# Altium schematic sheet power.SchDoc: GPN-Badge
size A4; Address4: Niklas Fauth; Revision: V2.0; SheetNumber: 2; SheetTotal: 3
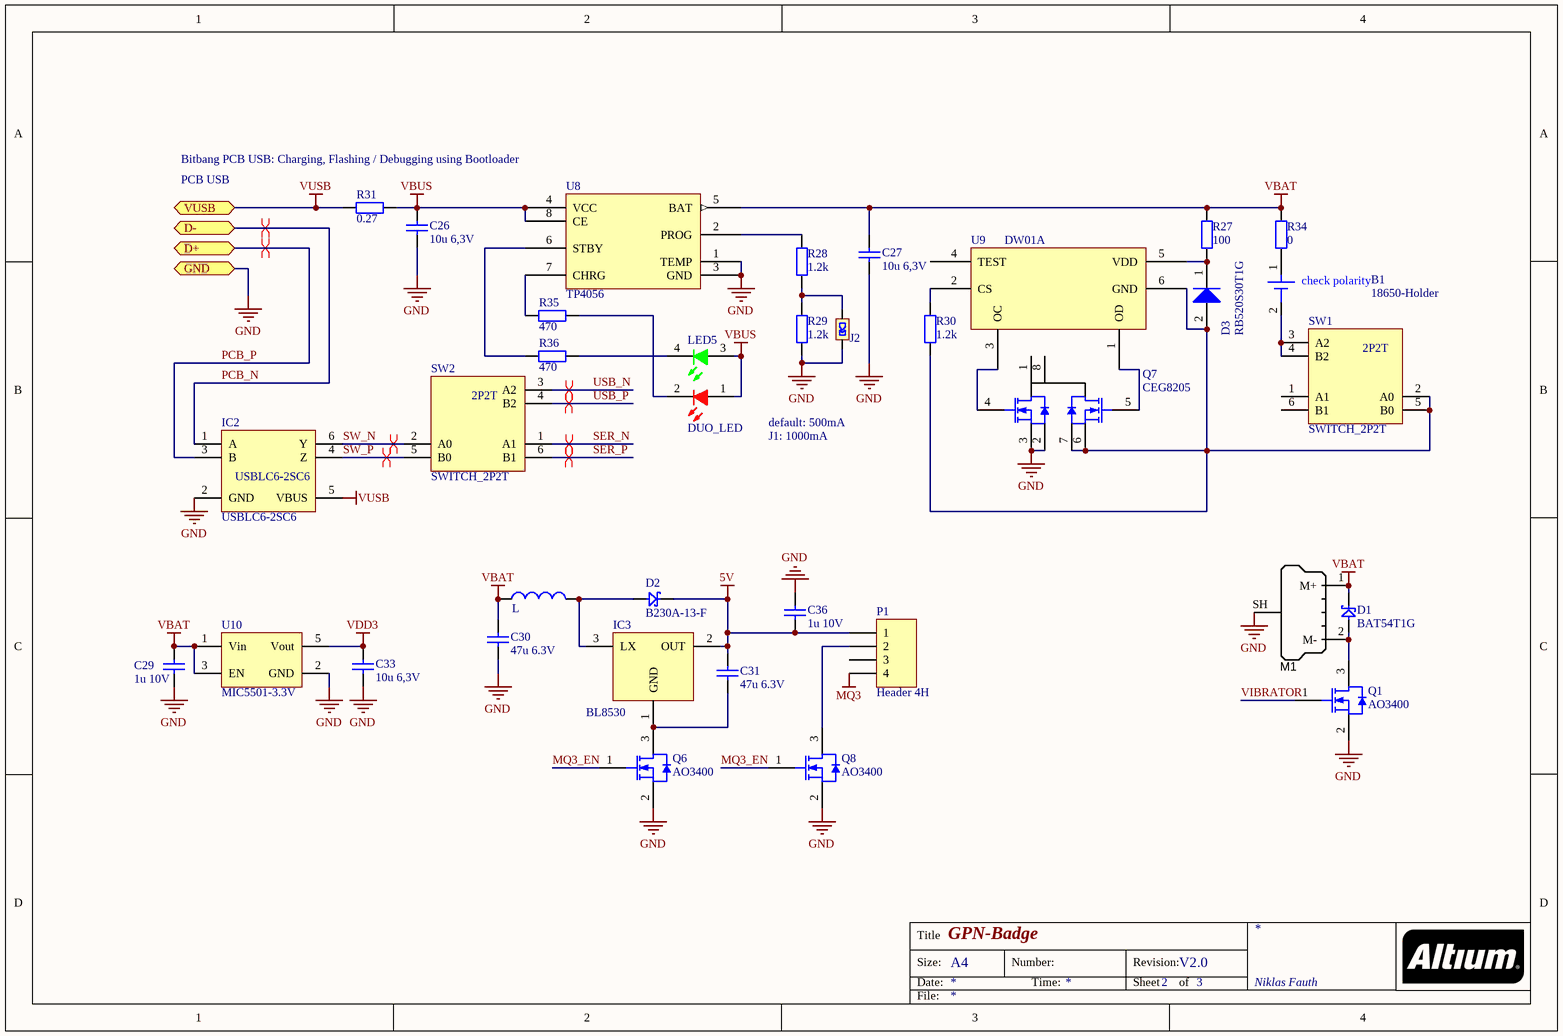
[diagram p0: power.SchDoc]

## Parts
B1  18650-Holder  [18650–Holder-SMD]
C26  10u 6,3V  [C-0603-H]
C27  10u 6,3V  [C-0603-H]
C29  1u 10V  [C-0603-M]
C30  47u 6.3V  [C-0805-M]
C31  47u 6.3V  [C-0805-M]
C33  10u 6,3V  [C-0603-H]
C36  1u 10V  [C-0603-M]
D1  BAT54T1G  [SOD123]
D2  B230A-13-F  [DIODE-SMA]
D3  RB520S30T1G  [ONSC-SOD-523-2-502-01_V]
IC2  USBLC6-2SC6  [SOT23-6]
IC3  BL8530  [SOT89-150P409X160-3N]
J2  jumper  [JUMPER 1-1]  (value not drawn)
L1  L  [L]
LED5  DUO_LED  [LEDDUO]
M1  VIBRATOR  [VIBRATOR_SMD]  (value not drawn)
P1  Header 4H  [HDR1X4H]
Q1  AO3400  [AO-SOT23-3_V]
Q6  AO3400  [AO-SOT23-3_V]
Q7  CEG8205  [SOP64P640X265-8N]
Q8  AO3400  [AO-SOT23-3_V]
R27  100  [R-0603-M]
R28  1.2k  [R-0603-M]
R29  1.2k  [R-0603-M]
R30  1.2k  [R-0603-M]
R31  0.27  [R-1206-M]
R34  0  [R-0603-M]
R35  470  [R-0603-M]
R36  470  [R-0603-M]
SW1  SWITCH_2P2T  [SWITCH_THT]
SW2  SWITCH_2P2T  [SWITCH_THT]
U8  TP4056  [SOIC127P600X20_HS-9N]
U9  DW01A  [SOT23-6]
U10  MIC5501-3.3V  [SOT23-5]

## Ports
D+, D-, GND, VUSB

## Nets
5V: C31.2 C36.2 D2.2(kt) IC3.2(OUT) P1.1
GND: C26.1 C27.1 C29.1 C30.1 C33.1 C36.1 IC2.2(GND) J2.2 M1.SH(Shell) Q1.2(S) Q6.2(S) Q7.2(S1) Q7.3(S1) Q8.2(S) R29.1 U8.1(TEMP) U8.3(GND) U10.2(GND) ; port GND
MQ3: P1.4
VBAT: C27.2 C29.2 C30.2 D1.2(kt) L1.1 M1.1(M+) R27.2 R34.2 U8.5(BAT) U10.1(Vin) U10.3(EN)
VBUS: C26.2 LED5.1(A) LED5.3(A) R31.2 U8.4(VCC) U8.8(CE)
VDD3: C33.2 U10.5(Vout)
VUSB: IC2.5(VBUS) R31.1 ; port VUSB
MQ3_EN: Q6.1(G) Q8.1(G)
PCB_N: IC2.1(A) ; port D-
PCB_P: IC2.3(B) ; port D+
SER_N: SW2.1(A1)
SER_P: SW2.6(B1)
SW_N: IC2.6(Y) SW2.2(A0)
SW_P: IC2.4(Z) SW2.5(B0)
USB_N: SW2.3(A2)
USB_P: SW2.4(B2)
VIBRATOR: Q1.1(G)
NetB1_1: B1.1 R34.1
NetB1_2: B1.2 SW1.3(A2) SW1.4(B2)
NetC31_1: C31.1 IC3.1(GND) Q6.3(D)
NetD1_1: D1.1(an) M1.2(M-) Q1.3(D)
NetD2_1: D2.1(an) IC3.3(LX) L1.2
NetD3_1: D3.1(K) R27.1 U9.5(VDD)
NetD3_2: D3.2(A) Q7.6(S2) Q7.7(S2) R30.1 SW1.2(A0) SW1.5(B0) U9.6(GND)
NetJ2_1: J2.1 R28.1 R29.2
NetLED5_2: LED5.2(K) R35.2
NetLED5_4: LED5.4(K) R36.2
NetP1_2: P1.2 Q8.3(D)
NetQ7_4: Q7.4(G1) U9.3(OC)
NetQ7_5: Q7.5(G2) U9.1(OD)
NetR28_2: R28.2 U8.2(PROG)
NetR30_2: R30.2 U9.2(CS)
NetR35_1: R35.1 U8.7(CHRG)
NetR36_1: R36.1 U8.6(STBY)

Not connected (* = marked no-connect by the designer): P1 3; Q7 1(S) 8(D); SW1 1(A1) 6(B1); U9 4(TEST)

## Layout directives
differential pair: PCB_N, PCB_P, SER_N, SER_P, SW_N, SW_P, USB_N, USB_P

## Notes on the sheet
- Bitbang PCB USB: Charging, Flashing / Debugging using Bootloader
- PCB USB
- default: 500mA
- J1: 1000mA
- Title
- Size:
- Date:
- A4
- Number:
- Time:
- Revision:
- Sheet
- of
- File:
- (in symbol 18650–Holder) check polarity
- (in symbol SWITCH_2P2T) 2P2T

## Library data of the parts
B1 = 18650–Holder
C26 C27 C33 = C-0603-10u-6,3V: Capacitor 10uF 6,3V; Supplier 1: Mouser; Supplier Part Number 1: 80-C0603C106M9P
C29 C36 = C-0603-1u-10V: Capacitor 1uF 10V; Supplier 1: Mouser; Supplier Part Number 1: 80-C0603C105K8P
C30 C31 = C-0805-47u-6.3V: Capacitor 47u 6.3V; Supplier 1: Mouser; Supplier Part Number 1: 80-C0805C476M9P
D1 = D-BAT54T1G: Supplier 1: Mouser; Supplier Part Number 1: 863-BAT54T1G
D2 = D-B230A-13-F: Supplier 1: Mouser; Supplier Part Number 1: 621-B230A-F
D3 = CMP-1055-00482-1: Schottky Barrier Diode, 2-Pin SOD-523, Pb-Free, Tape and Reel; Manufacturer: On Semiconductor; Configuration: Single; PackageReference: SOD-523-2-502-01; ComponentLink2URL: http://www.onsemi.cn/pub_link/Collateral/RB520S30T1-D.PDF; RoHS: TRUE; ComponentLink2Description: Datasheet; Mounting Technology: Surface Mount; ComponentLink1Description: Manufacturer URL; PackageDescription: 2-Pin SOD, Body 1.2 x 0.8 mm; PartNumber: RB520S30T1G; PackageVersion: Rev. E, 09/2010; DatasheetVersion: Rev. 10; ComponentLink1URL: http://www.onsemi.com/; Packing: Tape and Reel; ComponentLink3Description: Package Specification; ComponentLink3URL: http://www.onsemi.com/pub_link/Collateral/502-01.PDF
IC2 = USBLC6-2SC6: USB protection
J2 = jumper 1-1
M1 = VIBRATOR: rawr
P1 = Header 4H: Header, 4-Pin, Right Angle; LatestRevisionDate: 17-Jul-2002; LatestRevisionNote: Re-released for DXP Platform.; Publisher: Altium Limited
Q1 Q6 Q8 = CMP-0278-00001-1: N-channel Enhancement Mode Field-Effect Transistor; 5.8A/30V; Manufacturer: Alpha and Omega; Channel Type: N; Drain-Source Voltage Limit: 30 V; Junction Temperature: -55 to 150 degC; Gate-Source Voltage Limit: +/-12 V; PackageDescription: 3-Pin SOT23, 3.016 x 2.8 mm Body, 0.95 mm Pitch; ComponentLink2Description: Datasheet; DatasheetVersion: Rev.8, 12/2011; ComponentLink3URL: http://www.aosmd.com/res/packaging_information/SOT-23.pdf; Storage Temperature: -55 to 150 degC; ComponentLink3Description: Package Specification; PackageReference: SOT23; ComponentLink1Description: Manufacturer URL; Mounting Technology: Surface Mount; ComponentLink1URL: http://www.aosmd.com/; PartNumber: AO3400; ComponentLink2URL: http://www.aosmd.com/res/data_sheets/AO3400.pdf
Q7 = MOSFET-CEG8205: Dual mini mosfet 20V 4.5A; Supplier 1: AliExpress
R27 = R-0603-100: Resistor 100; Supplier 1: Mouser; Supplier Part Number 1: 71-CRCW0603-100-E3
R28-R30 = R-0603-1k2: Resistor 1.2k
R31 = R-1206-0R27: Resistor 0.27; Supplier 1: Mouser; Supplier Part Number 1: 71-RCWE1206R270FKEA
R34 = R-0603-0: Resistor 0; Supplier 1: Mouser; Supplier Part Number 1: 71-CRCW0603-0-E3; Resistance: 0
R35 R36 = R-0603-470: Resistor 470; Supplier 1: Mouser; Supplier Part Number 1: 71-CRCW0603-470K-E3
U8 = TP4056: 1A standalone linear charging IC; Supplier 1: AliExpress
U9 = DW01A: Single Cell LiIon LiPo Protection
U10 = MIC5501-3.3V: Supplier 1: Mouser; Supplier Part Number 1: 998-MIC5501-3.0YM5TR